# EAGLE design io_expander (EAGLE 9.5.2)
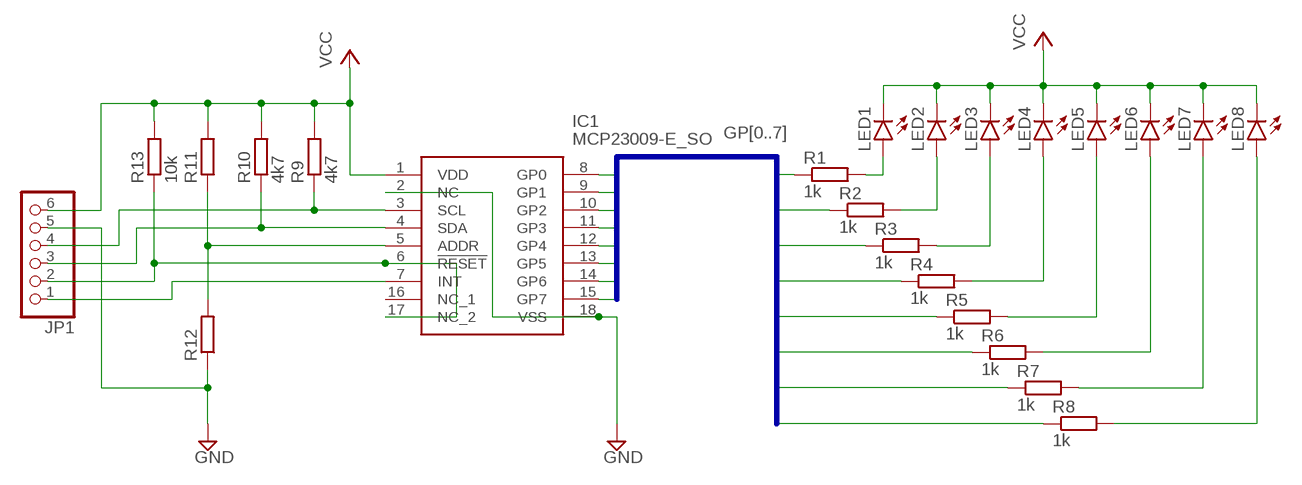
[diagram p0: schematic, sheet 1]

## Parts
IC1  MCP23009-E_SO  [SOIC127P1030X265-18N]
JP1  PINHD-1X6  [1X06]
LED1  LEDCHIP-LED0805  [CHIP-LED0805]
LED2  LEDCHIP-LED0805  [CHIP-LED0805]
LED3  LEDCHIP-LED0805  [CHIP-LED0805]
LED4  LEDCHIP-LED0805  [CHIP-LED0805]
LED5  LEDCHIP-LED0805  [CHIP-LED0805]
LED6  LEDCHIP-LED0805  [CHIP-LED0805]
LED7  LEDCHIP-LED0805  [CHIP-LED0805]
LED8  LEDCHIP-LED0805  [CHIP-LED0805]
R1  1k  R-EU_R0805  [R0805]
R2  1k  R-EU_R0805  [R0805]
R3  1k  R-EU_R0805  [R0805]
R4  1k  R-EU_R0805  [R0805]
R5  1k  R-EU_R0805  [R0805]
R6  1k  R-EU_R0805  [R0805]
R7  1k  R-EU_R0805  [R0805]
R8  1k  R-EU_R0805  [R0805]
R9  4k7  R-EU_R0805  [R0805]
R10  4k7  R-EU_R0805  [R0805]
R11  R-EU_R0805  [R0805]
R12  R-EU_R0805  [R0805]
R13  10k  R-EU_R0805  [R0805]

## Nets
GND: IC1.2(NC) IC1.18(VSS) JP1.5 R12.1
GP0: IC1.8(GP0) R1.1
GP1: IC1.9(GP1) R2.1
GP2: IC1.10(GP2) R3.1
GP3: IC1.11(GP3) R4.1
GP4: IC1.12(GP4) R5.1
GP5: IC1.13(GP5) R6.1
GP6: IC1.14(GP6) R7.1
GP7: IC1.15(GP7) R8.1
N$1: IC1.5(ADDR) R11.1 R12.2
N$2: IC1.3(SCL) JP1.4 R9.1
N$3: IC1.4(SDA) JP1.3 R10.1
N$4: IC1.6(!RESET) IC1.17(NC_2) JP1.2 R13.1
N$5: IC1.7(INT) JP1.1
N$9: LED1.A R1.2
N$10: LED2.A R2.2
N$11: LED3.A R3.2
N$12: LED4.A R4.2
N$13: LED5.A R5.2
N$14: LED6.A R6.2
N$15: LED7.A R7.2
N$16: LED8.A R8.2
VCC: IC1.1(VDD) JP1.6 LED1.C LED2.C LED3.C LED4.C LED5.C LED6.C LED7.C LED8.C R9.2 R10.2 R11.2 R13.2
Unconnected: IC1.16(NC_1)

## Buses
GP[0..7]

## Library data of the parts
IC1 = MCP23009-E_SO:MCP23009-E_SO: 8-bit Input/Output Expander, I2C Source: Datasheet <https://componentsearchengine.com/Datasheets/2/MCP23009-E_SO.pdf>; DESCRIPTION: 8-bit Input/Output Expander, I2C; FARNELL_PART_NUMBER: 1699841; FARNELL_PRICE-STOCK: http://uk.farnell.com/jsp/displayProduct.jsp?sku=1699841&action=view; HEIGHT: 2.65mm; MANUFACTURER_NAME: Microchip; MANUFACTURER_PART_NUMBER: MCP23009-E/SO
JP1 = pinhead:PINHD-1X6: PIN HEADER
LED1-LED8 = led:LED: LED OSRAM: - CHIPLED LG R971, LG N971, LY N971, LG Q971, LY Q971, LO R971, LY R971 LH N974, LH R974 LS Q976, LO Q976, LY Q976 LO Q996 - Hyper CHIPLED LW Q18S LB Q993, LB Q99A, LB R99A - SideLED LS A670, LO A670, LY A670, LG A670, LP A670 LB A673, LV A673, LT A673, LW A673 LH A674 LY A675 LS A676, LA A676, LO A676, LY A676, LW A676 LS A679, LY A679, LG A679 - Hyper Micro SIDELED® LS Y876, LA Y876, LO Y876, LY Y876 LT Y87S - SmartLED LW L88C, LW L88S LB L89C, LB L89S, LG L890 LS L89K, LO L89K, LY L89K LS L896, LA L896, LO L896, LY L896 - TOPLED LS T670, LO T670, LY T670, LG T670, LP T670 LSG T670, LSP T670, LSY T670, LOP T670, LYG T670 LG T671, LOG T671, LSG T671 LB T673, LV T673, LT T673, LW T673 LH T674 LS T676, LA T676, LO T676, LY T676, LB T676, LH T676, LSB T676, LW T676 LB T67C, LV T67C, LT T67C, LS T67K, LO T67K, LY T67K, LW E67C LS E67B, LA E67B, LO E67B, LY E67B, LB E67C, LV E67C, LT E67C LW T67C LS T679, LY T679, LG T679 LS T770, LO T770, LY T770, LG T770, LP T770 LB T773, LV T773, LT T773, LW T773 LH T774 LS E675, LA E675, LY E675, LS T675 LS T776, LA T776, LO T776, LY T776, LB T776 LHGB T686 LT T68C, LB T68C - Hyper Mini TOPLED® LB M676 - Mini TOPLED Santana® LG M470 LS M47K, LO M47K, LY M47K Source: http://www.osram.convergy.de LUXEON: - LUMILED® LXK2-PW12-R00, LXK2-PW12-S00, LXK2-PW14-U00, LXK2-PW14-V00 LXK2-PM12-R00, LXK2-PM12-S00, LXK2-PM14-U00 LXK2-PE12-Q00, LXK2-PE12-R00, LXK2-PE12-S00, LXK2-PE14-T00, LXK2-PE14-U00 LXK2-PB12-K00, LXK2-PB12-L00, LXK2-PB12-M00, LXK2-PB14-N00, LXK2-PB14-P00, LXK2-PB14-Q00 LXK2-PR12-L00, LXK2-PR12-M00, LXK2-PR14-Q00, LXK2-PR14-R00 LXK2-PD12-Q00, LXK2-PD12-R00, LXK2-PD12-S00 LXK2-PH12-R00, LXK2-PH12-S00 LXK2-PL12-P00, LXK2-PL12-Q00, LXK2-PL12-R00 Source: www.luxeon.com KINGBRIGHT: KA-3528ASYC Source: www.kingbright.com
R1-R13 = rcl:R-EU_: RESISTOR, European symbol; SPICEPREFIX: R

## Board
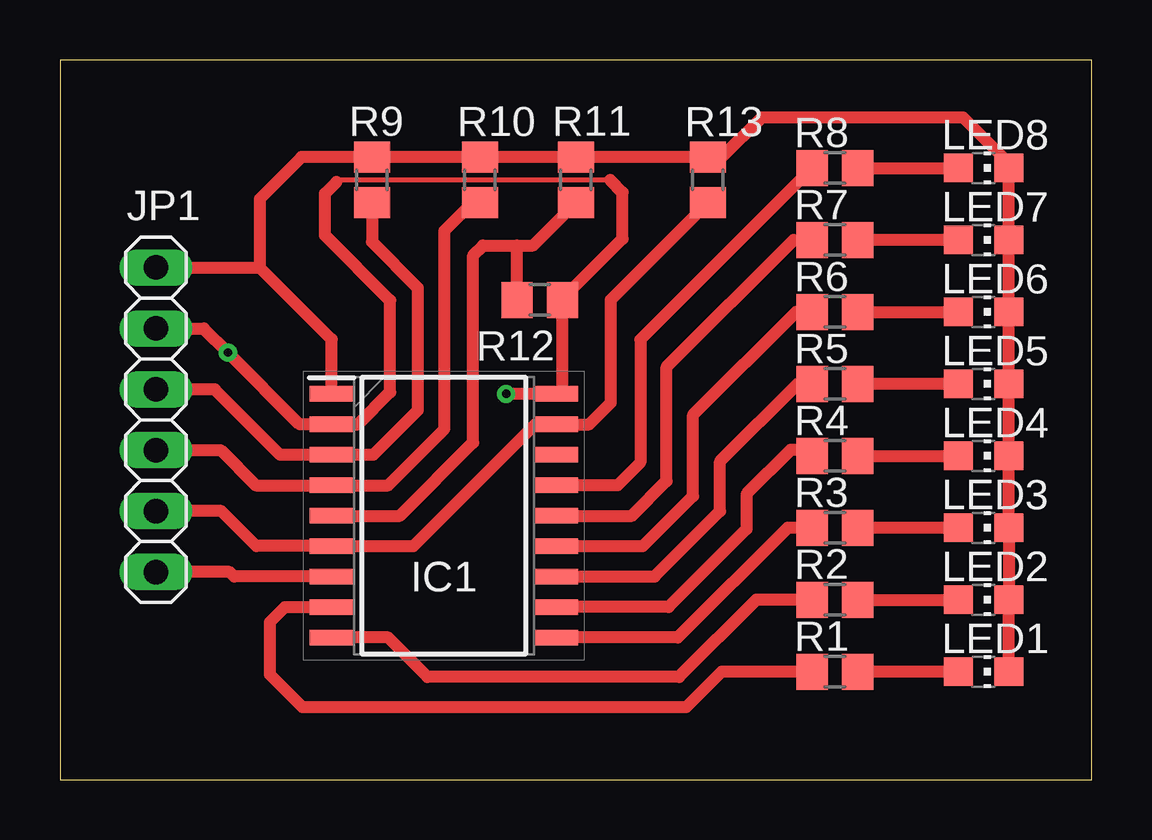
[diagram p1: board, top side]
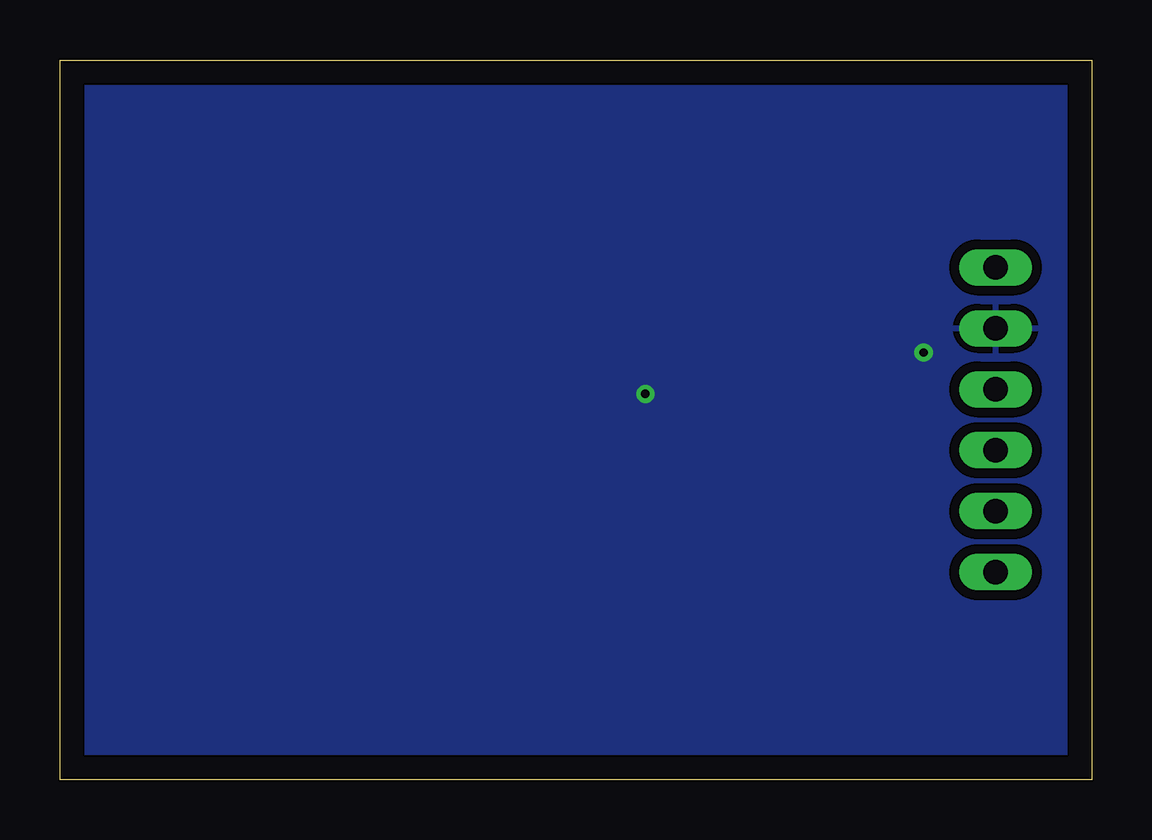
[diagram p2: board, bottom side, seen from below]

Size 43 x 30 mm. Coordinates in mm from the lower left corner, seen from the top.
Outline: 0,0 43,0 43,30 0,30 0,0
Copper layers (1*16): Top 0.035mm / dielectric 1.5mm / Bottom 0.035mm
Design rules "default": minimum track width 6mil, minimum drill 0.35mm, track to track 6mil, track to pad 6mil, pad to pad 6mil, via to via 6mil, smd to smd 6mil, copper to edge 40mil, drill to drill 6mil, minimum pad ring 10mil, minimum via ring 8mil, stop-mask expansion 4mil, vias tented up to drill 0mil, thermal gap 10mil

### Footprints (pad centres in the part's own frame; a part is rotated, then mirrored left to right if it is on the bottom)
SOIC127P1030X265-18N = smd 1.85 x 0.65: 1 -4.675,5.08; 2 -4.675,3.81; 3 -4.675,2.54; 4 -4.675,1.27; 5 -4.675,0; 6 -4.675,-1.27; 7 -4.675,-2.54; 8 -4.675,-3.81; 9 -4.675,-5.08; 10 4.675,-5.08; 11 4.675,-3.81; 12 4.675,-2.54; 13 4.675,-1.27; 14 4.675,0; 15 4.675,1.27; 16 4.675,2.54; 17 4.675,3.81; 18 4.675,5.08
1X06 = drill 1.016 long: 1 -6.35,0; 2 -3.81,0; 3 -1.27,0; 4 1.27,0; 5 3.81,0; 6 6.35,0
CHIP-LED0805 = smd 1.2 x 1.2: A 0,-1.05; C 0,1.05
R0805 = smd 1.3 x 1.5: 1 -0.95,0; 2 0.95,0

### Placement (x,y rotation side)
IC1  16,11 0 top
JP1  4,15 90 top
LED1  38.5,4.5 270 top
LED2  38.5,7.5 270 top
LED3  38.5,10.5 270 top
LED4  38.5,13.5 270 top
LED5  38.5,16.5 270 top
LED6  38.5,19.5 270 top
LED7  38.5,22.5 270 top
LED8  38.5,25.5 270 top
R1  32.3,4.5 0 top
R2  32.3,7.5 0 top
R3  32.3,10.5 0 top
R4  32.3,13.5 0 top
R5  32.3,16.5 0 top
R6  32.3,19.5 0 top
R7  32.3,22.5 0 top
R8  32.3,25.5 0 top
R9  13,25 90 top
R10  17.5,25 90 top
R11  21.5,25 90 top
R12  20,20 180 top
R13  27,25 90 top

### Tracks (layer width: path | path; a pad name or v marks a point on that pad's centre or on a via)
GND  (via drill 0.35)
  Top 0.203: 22.94,25 11.6,25
  Top 0.254: 11.6,25 11.53,24.91
  Top 0.508: 20.95,16.11 | 20.95,16.11 R12.1 20.95,20.05 23.45,22.55 23.45,24.47 22.94,25 | 20.95,16.11 20.7,16.11 IC1.18 v18.6,16.08 | 11.53,24.91 11.05,24.43 11.05,22.69 13.77,19.97 13.77,16.15 12.43,14.81 IC1.2 9.99,14.81 v7,17.8 5.99,18.81 JP1.5
  Bottom 0.508: JP1.5 4.03,18.84
  pour Bottom (isolate 0.406): 0.3,29.7 42.7,29.7 42.7,0.3 0.3,0.3
GP0
  Top 0.508: R1.1 27.58,4.5 26.1,3.02 10.11,3.02 8.76,4.37 8.76,6.57 9.38,7.19 IC1.8
GP1
  Top 0.508: R2.1 29.03,7.5 25.81,4.28 15.32,4.28 13.68,5.92 IC1.9
GP2
  Top 0.508: R3.1 30.34,10.5 25.76,5.92 IC1.10
GP3
  Top 0.508: R4.1 31.11,13.74 30.46,13.74 28.62,11.9 28.62,10.44 25.37,7.19 IC1.11
GP4
  Top 0.508: IC1.12 24.79,8.46 27.52,11.19 27.52,13.27 30.75,16.5 R5.1
GP5
  Top 0.508: IC1.13 24.3,9.73 26.39,11.82 26.39,15.2 30.69,19.5 R6.1
GP6
  Top 0.508: IC1.14 23.85,11 25.29,12.44 25.29,17.2 30.59,22.5 R7.1
GP7
  Top 0.508: R8.1 24.19,18.34 24.19,13.22 23.24,12.27 IC1.15
N$1
  Top 0.508: R12.2 19.05,22.27 | IC1.5 14.17,11 17.22,14.05 17.22,21.86 17.63,22.27 19.05,22.27 | R11.1 19.72,22.27 19.05,22.27
N$2
  Top 0.508: R9.1 13,22.41 14.91,20.5 14.91,15.39 13.06,13.54 IC1.3 9.18,13.54 6.45,16.27 JP1.4
N$3
  Top 0.508: R10.1 17.2,24.05 16.03,22.88 16.03,14.62 13.68,12.27 IC1.4 8.15,12.27 6.69,13.73 JP1.3
N$4
  Top 0.508: JP1.2 6.72,11.19 8.18,9.73 IC1.6 14.73,9.73 19.81,14.81 IC1.17 22.06,14.81 22.96,15.71 22.96,20.01 R13.1
N$5
  Top 0.508: JP1.1 7.08,8.65 7.27,8.46 IC1.7
N$9
  Top 0.508: LED1.A R1.2
N$10
  Top 0.508: R2.2 LED2.A
N$11
  Top 0.508: LED3.A R3.2
N$12
  Top 0.508: R4.2 LED4.A
N$13
  Top 0.508: LED5.A R5.2
N$14
  Top 0.508: R6.2 LED6.A
N$15
  Top 0.508: LED7.A R7.2
N$16
  Top 0.508: R8.2 LED8.A
VCC
  Top 0.508: LED1.C LED2.C LED3.C LED4.C LED5.C LED6.C LED7.C LED8.C 39.55,25.7 37.65,27.6 29.25,27.6 27.6,25.95 R13.2 R11.2 R10.2 R9.2 10.07,25.95 8.32,24.2 8.32,21.35 | JP1.6 8.32,21.35 | IC1.1 11.32,18.35 8.32,21.35